# EAGLE design untitled (EAGLE 9.6.1)
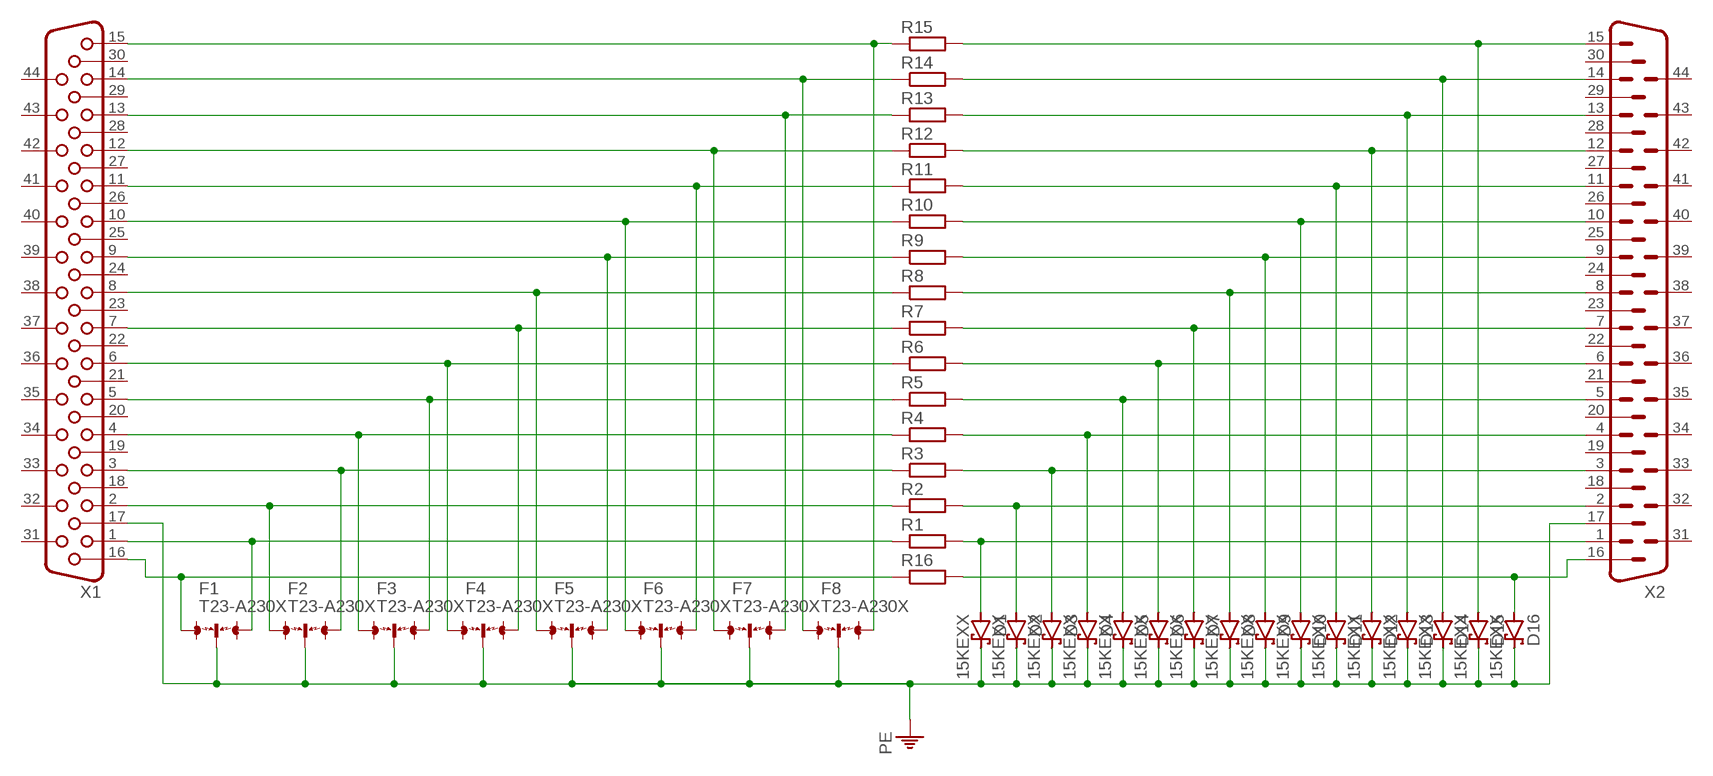
[diagram p0: schematic, sheet 1]

## Parts
D1  15KEXX  [CB429-17]
D2  15KEXX  [CB429-17]
D3  15KEXX  [CB429-17]
D4  15KEXX  [CB429-17]
D5  15KEXX  [CB429-17]
D6  15KEXX  [CB429-17]
D7  15KEXX  [CB429-17]
D8  15KEXX  [CB429-17]
D9  15KEXX  [CB429-17]
D10  15KEXX  [CB429-17]
D11  15KEXX  [CB429-17]
D12  15KEXX  [CB429-17]
D13  15KEXX  [CB429-17]
D14  15KEXX  [CB429-17]
D15  15KEXX  [CB429-17]
D16  15KEXX  [CB429-17]
F1  T23-A230X  [T23-A230X]
F2  T23-A230X  [T23-A230X]
F3  T23-A230X  [T23-A230X]
F4  T23-A230X  [T23-A230X]
F5  T23-A230X  [T23-A230X]
F6  T23-A230X  [T23-A230X]
F7  T23-A230X  [T23-A230X]
F8  T23-A230X  [T23-A230X]
R1  R-EU_R1210  [R1210]
R2  R-EU_R1210  [R1210]
R3  R-EU_R1210  [R1210]
R4  R-EU_R1210  [R1210]
R5  R-EU_R1210  [R1210]
R6  R-EU_R1210  [R1210]
R7  R-EU_R1210  [R1210]
R8  R-EU_R1210  [R1210]
R9  R-EU_R1210  [R1210]
R10  R-EU_R1210  [R1210]
R11  R-EU_R1210  [R1210]
R12  R-EU_R1210  [R1210]
R13  R-EU_R1210  [R1210]
R14  R-EU_R1210  [R1210]
R15  R-EU_R1210  [R1210]
R16  R-EU_R1210  [R1210]
X1  HF44H  [HDF44H]
X2  HM44H  [HDM44H]

## Nets
N$2: D16.A R16.2 X2.16
N$3: D1.A R1.2 X2.1
N$4: D2.A R2.2 X2.2
N$5: D3.A R3.2 X2.3
N$6: D4.A R4.2 X2.4
N$7: D5.A R5.2 X2.5
N$8: D6.A R6.2 X2.6
N$9: D7.A R7.2 X2.7
N$10: D8.A R8.2 X2.8
N$11: D9.A R9.2 X2.9
N$12: D10.A R10.2 X2.10
N$13: D11.A R11.2 X2.11
N$14: D12.A R12.2 X2.12
N$15: D13.A R13.2 X2.13
N$16: D14.A R14.2 X2.14
N$17: F1.3 R1.1 X1.1
N$18: F2.1 R2.1 X1.2
N$19: F2.3 R3.1 X1.3
N$20: F3.1 R4.1 X1.4
N$21: F3.3 R5.1 X1.5
N$22: F4.1 R6.1 X1.6
N$23: F4.3 R7.1 X1.7
N$24: F5.1 R8.1 X1.8
N$25: F5.3 R9.1 X1.9
N$26: F6.1 R10.1 X1.10
N$27: F6.3 R11.1 X1.11
N$28: F7.1 R12.1 X1.12
N$29: F7.3 R13.1 X1.13
N$30: F8.1 R14.1 X1.14
N$31: F8.3 R15.1 X1.15
N$32: F1.1 R16.1 X1.16
N$33: D15.A R15.2 X2.15
PE: D1.C D2.C D3.C D4.C D5.C D6.C D7.C D8.C D9.C D10.C D11.C D12.C D13.C D14.C D15.C D16.C F1.2 F2.2 F3.2 F4.2 F5.2 F6.2 F7.2 F8.2 X1.17 X2.17
Unconnected: X1.18 X1.19 X1.20 X1.21 X1.22 X1.23 X1.24 X1.25 X1.26 X1.27 X1.28 X1.29 X1.30 X1.31 X1.32 X1.33 X1.34 X1.35 X1.36 X1.37 X1.38 X1.39 X1.40 X1.41 X1.42 X1.43 X1.44 X2.18 X2.19 X2.20 X2.21 X2.22 X2.23 X2.24 X2.25 X2.26 X2.27 X2.28 X2.29 X2.30 X2.31 X2.32 X2.33 X2.34 X2.35 X2.36 X2.37 X2.38 X2.39 X2.40 X2.41 X2.42 X2.43 X2.44

## Library data of the parts
D1-D16 = diode:15KEXX: DIODE
F1-F8 = discrete:T23-A230X: 3-electrode arrester B88069X8740B502 Source: EPCOS .. t23a230xx8740.pdf
R1-R16 = rcl:R-EU_: RESISTOR, European symbol; SPICEPREFIX: R
X1 = con-subd:HF44: SUB-D; OC_FARNELL: unknown; OC_NEWARK: unknown
X2 = con-subd:HM44: SUB-D; OC_FARNELL: unknown; OC_NEWARK: unknown

## Board
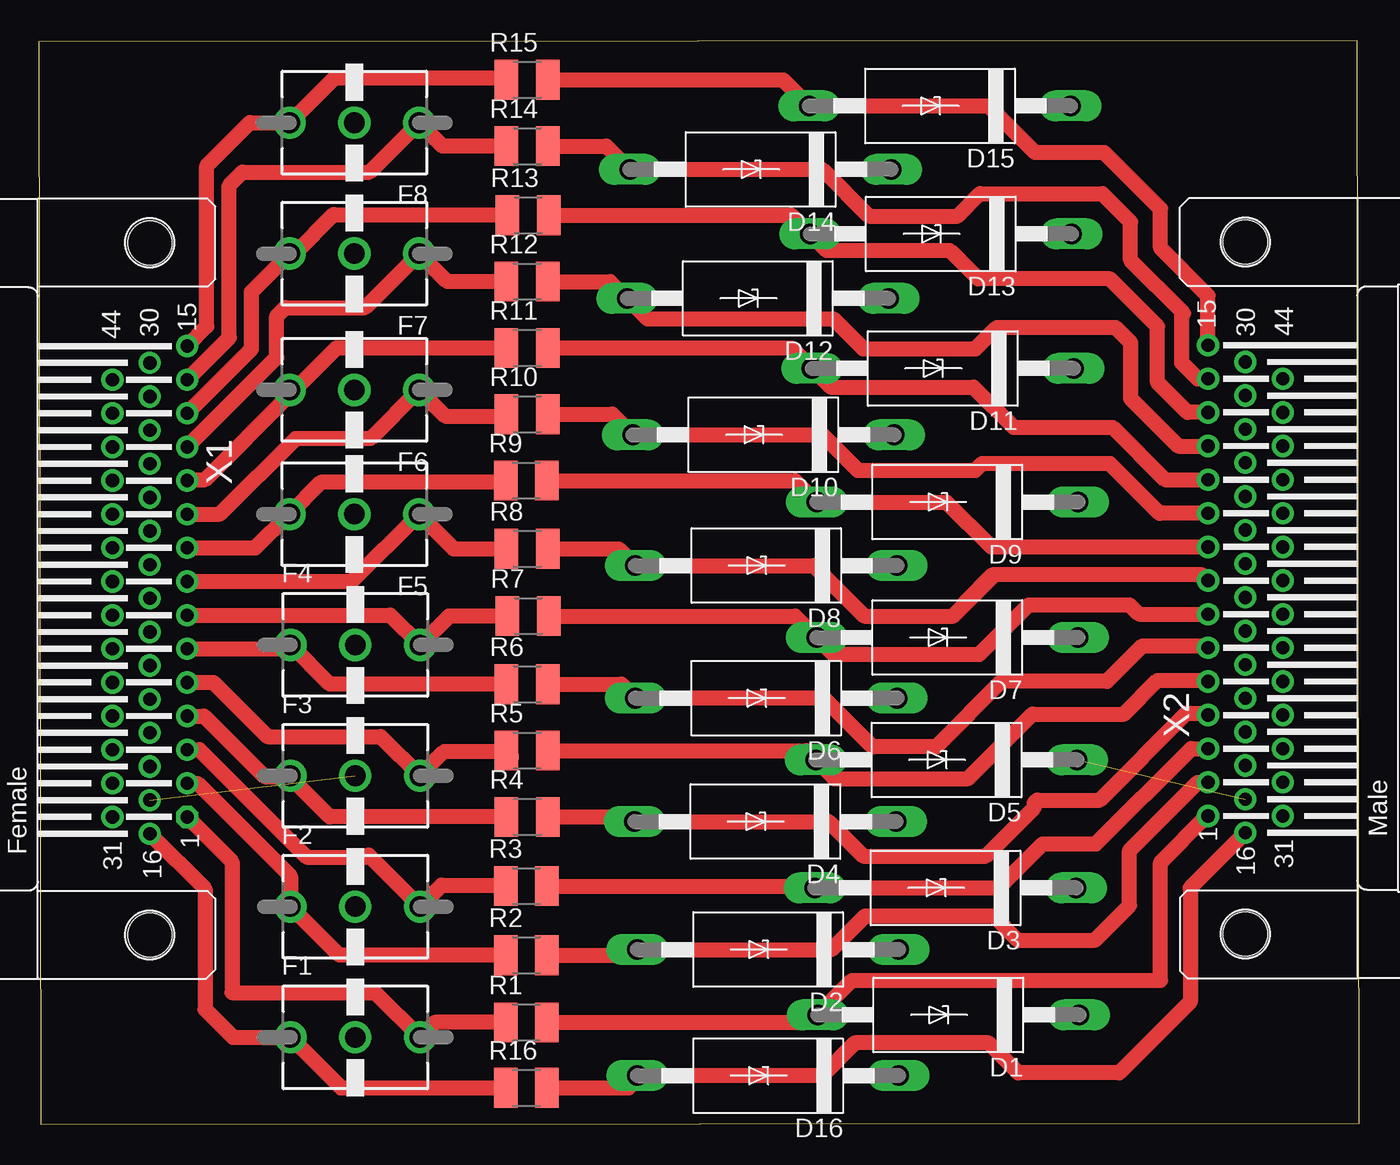
[diagram p1: board, top side]
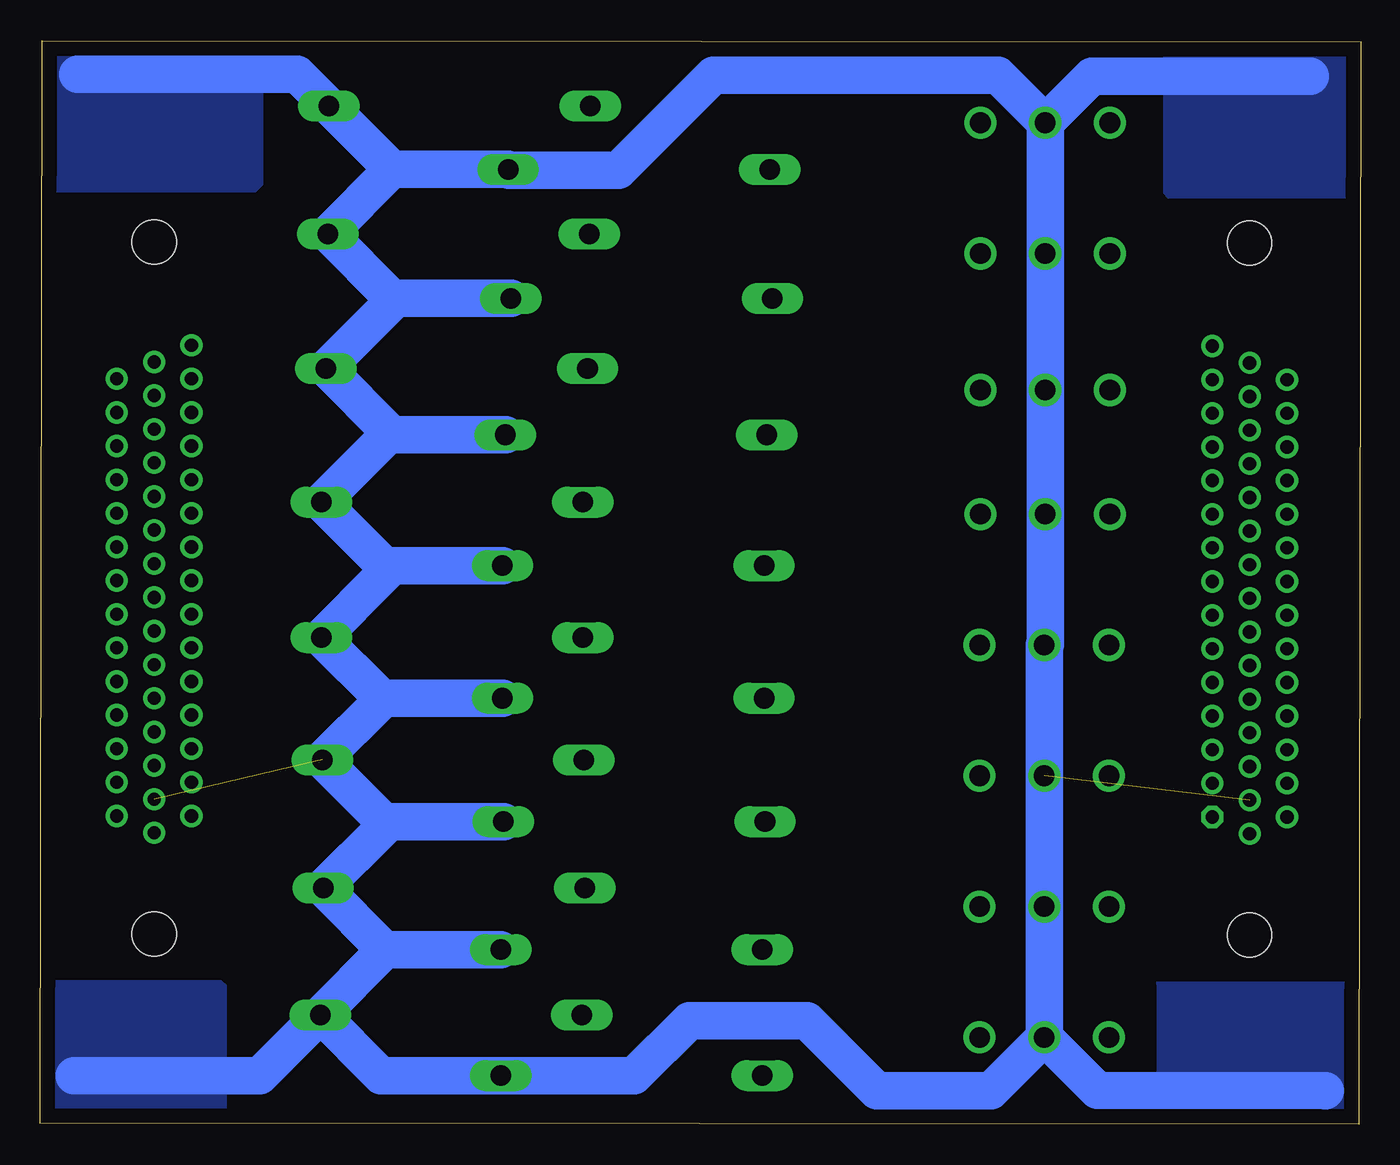
[diagram p2: board, bottom side, seen from below]

Size 89.78 x 73.65 mm. Coordinates in mm from the lower left corner, seen from the top.
Outline: 0.13,0 89.78,0.06 89.65,73.65 0,73.59 0.13,0
Copper layers (1*16): Top 0.035mm / dielectric 1.5mm / Bottom 0.035mm
Design rules "default": minimum track width 15mil, minimum drill 32mil, track to track 12mil, track to pad 12mil, pad to pad 12mil, via to via 12mil, smd to smd 6mil, copper to edge 40mil, drill to drill 40mil, minimum pad ring 12mil, minimum via ring 12mil, stop-mask expansion 4mil, vias tented up to drill 0mil, thermal gap 10mil

### Footprints (pad centres in the part's own frame; a part is rotated, then mirrored left to right if it is on the bottom)
CB429-17 = drill 1.397 long: A 8.89,0; C -8.89,0
T23-A230X = drill 1.4 pad 2.184: 1 -4.4,0; 2 0,0; 3 4.4,0
R1210 = smd 1.6 x 2.7: 1 -1.4,0; 2 1.4,0
HDF44H = drill 0.9 octagon: 1 15.497,2.54 | drill 0.9: 2 13.211,2.54; 3 10.925,2.54; 4 8.639,2.54; 5 6.353,2.54; 6 4.067,2.54; 7 1.781,2.54; 8 -0.505,2.54; 9 -2.791,2.54; 10 -5.077,2.54; 11 -7.363,2.54; 12 -9.649,2.54; 13 -11.935,2.54; 14 -14.221,2.54; 15 -16.507,2.54; 16 16.64,0; 17 14.354,0; 18 12.068,0; 19 9.782,0; 20 7.496,0; 21 5.21,0; 22 2.924,0; 23 0.638,0; 24 -1.648,0; 25 -3.934,0; 26 -6.22,0; 27 -8.506,0; 28 -10.792,0; 29 -13.078,0; 30 -15.364,0; 31 15.497,-2.54; 32 13.211,-2.54; 33 10.925,-2.54; 34 8.639,-2.54; 35 6.353,-2.54; 36 4.067,-2.54; 37 1.781,-2.54; 38 -0.505,-2.54; 39 -2.791,-2.54; 40 -5.077,-2.54; 41 -7.363,-2.54; 42 -9.649,-2.54; 43 -11.935,-2.54; 44 -14.221,-2.54 | hole 3: -23.52,0; 23.52,0
HDM44H = drill 0.9: 1 -15.497,2.54; 2 -13.211,2.54; 3 -10.925,2.54; 4 -8.639,2.54; 5 -6.353,2.54; 6 -4.067,2.54; 7 -1.781,2.54; 8 0.505,2.54; 9 2.791,2.54; 10 5.077,2.54; 11 7.363,2.54; 12 9.649,2.54; 13 11.935,2.54; 14 14.221,2.54; 15 16.507,2.54; 16 -16.64,0; 17 -14.354,0; 18 -12.068,0; 19 -9.782,0; 20 -7.496,0; 21 -5.21,0; 22 -2.924,0; 23 -0.638,0; 24 1.648,0; 25 3.934,0; 26 6.22,0; 27 8.506,0; 28 10.792,0; 29 13.078,0; 30 15.364,0; 31 -15.497,-2.54; 32 -13.211,-2.54; 33 -10.925,-2.54; 34 -8.639,-2.54; 35 -6.353,-2.54; 36 -4.067,-2.54; 37 -1.781,-2.54; 38 0.505,-2.54; 39 2.791,-2.54; 40 5.077,-2.54; 41 7.363,-2.54; 42 9.649,-2.54; 43 11.935,-2.54; 44 14.221,-2.54 | hole 3: -23.52,0; 23.52,0

### Placement (x,y rotation side)
D1  61.85,7.43 180 top
D2  49.59,11.87 180 top
D3  61.66,16.07 180 top
D4  49.4,20.57 180 top
D5  61.72,24.77 180 top
D6  49.47,28.96 180 top
D7  61.79,33.08 180 top
D8  49.47,37.97 180 top
D9  61.79,42.29 180 top
D10  49.28,46.86 180 top
D11  61.47,51.37 180 top
D12  48.9,56.13 180 top
D13  61.34,60.52 180 top
D14  49.09,64.9 180 top
D15  61.28,69.22 180 top
D16  49.59,3.3 180 top
F1  21.53,5.91 0 top
F2  21.53,14.8 0 top
F3  21.53,23.69 0 top
F4  21.53,32.58 0 top
F5  21.46,41.47 180 top
F6  21.46,49.91 180 top
F7  21.46,59.18 180 top
F8  21.46,68.07 180 top
R1  33.15,6.92 0 top
R2  33.15,11.49 0 top
R3  33.15,16.19 0 top
R4  33.21,20.89 0 top
R5  33.21,25.4 0 top
R6  33.21,29.91 0 top
R7  33.27,34.54 0 top
R8  33.21,39.12 0 top
R9  33.15,43.75 0 top
R10  33.21,48.26 0 top
R11  33.21,52.77 0 top
R12  33.21,57.28 0 top
R13  33.27,61.79 0 top
R14  33.21,66.48 0 top
R15  33.21,70.99 0 top
R16  33.15,2.48 0 top
X1  7.56,36.39 270 top
X2  82.04,36.45 90 top

### Tracks (layer width: path | path; a pad name or v marks a point on that pad's centre or on a via)
N$2
  Top 1.016: R16.2 40.13,2.48 40.13,2.73 D16.A 53.28,3.3 55.5,5.52 64.58,5.52 66.61,3.49 73.47,3.49 78.3,8.32 78.3,16.06 X2.16
N$3
  Top 1.016: R1.2 52.45,6.92 D1.A 55.31,9.78 76.26,9.78 76.26,17.78 79.44,20.95 X2.1
N$4
  Top 1.016: R2.2 40.32,11.49 D2.A 53.91,11.87 56.2,14.16 64.9,14.16 66.55,12.51 71.82,12.51 74.17,14.86 74.17,18.61 78.8,23.24 X2.2
N$5
  Top 1.016: R3.2 52.64,16.19 D3.A 65.28,16.07 68.26,19.05 71.88,19.05 78.36,25.52 X2.3
N$6
  Top 1.016: R4.2 40.2,20.89 D4.A 53.72,20.57 56.07,18.22 64.39,18.22 67.69,21.53 67.69,21.84 67.88,22.03 72.14,22.03 78.04,27.94 79.37,27.94 X2.4
N$7
  Top 1.016: R5.2 52.2,25.4 D5.A 54.04,23.56 54.04,23.5 63.18,23.5 67.56,27.88 73.79,27.88 76.07,30.16 79.44,30.16 X2.5
N$8
  Top 1.016: R6.2 39.62,29.91 D6.A 53.4,28.96 56.71,25.65 61.02,25.65 65.47,30.1 72.64,30.1 75.06,32.51 79.37,32.51 X2.6
N$9
  Top 1.016: R7.2 51.43,34.54 D7.A 54.04,31.94 63.94,31.94 67.31,35.31 74.16,35.31 74.8,34.67 X2.7
N$10
  Top 1.016: R8.2 39.43,39.12 D8.A 52.71,37.97 56.13,34.54 62.17,34.54 64.84,37.21 64.84,37.33 | X2.8 79.12,37.33 64.84,37.33 | 64.84,37.33 63,35.5
N$11
  Top 1.016: R9.2 51.43,43.75 D9.A 61.72,42.29 64.77,39.24 X2.9
N$12
  Top 1.016: R10.2 38.99,48.26 D10.A 53.28,46.86 55.69,44.45 63.69,44.45 64.13,44.89 72.83,44.89 76.2,41.53 X2.10
N$13
  Top 1.016: R11.2 51.18,52.77 D11.A 53.85,50.1 63.56,50.1 66.29,47.37 73.02,47.37 76.58,43.81 X2.11
N$14
  Top 1.016: R12.2 38.86,57.28 D12.A 41.4,54.74 54.04,54.74 56.07,52.71 63.69,52.71 65.15,54.17 73.22,54.17 74.23,53.15 74.23,49.34 77.47,46.1 X2.12
N$15
  Top 1.016: R13.2 51.18,61.79 D13.A 53.56,59.4 61.94,59.4 63.88,57.47 72.83,57.47 76.07,54.23 76.07,50.42 78.11,48.38 X2.13
N$16
  Top 1.016: R14.2 38.61,66.48 D14.A 53.28,64.9 56.45,61.72 62.48,61.72 64.01,63.25 72.33,63.25 74.23,61.34 74.23,58.74 77.85,55.12 77.72,54.99 77.72,51.75 78.81,50.67 X2.14
N$17
  Top 1.016: X1.1 13.14,17.84 13.14,8.95 22.88,8.95 F1.3 26.94,6.92 R1.1
N$18
  Top 1.016: X1.2 10.8,23.17 17.13,16.85 F2.1 20.43,11.49 R2.1
N$19
  Top 1.016: X1.3 10.92,25.46 18.22,18.16 22.29,18.16 22.42,18.29 22.43,18.29 F2.3 27.39,16.26 31.68,16.26 R3.1
N$20
  Top 1.016: X1.4 11.24,27.75 15.37,23.62 17.06,23.62 | 17.06,23.62 F3.1 | 17.06,23.62 19.79,20.89 R4.1
N$21
  Top 1.016: X1.5 11.88,30.03 15.56,26.35 23.26,26.35 F3.3 27.58,25.34 31.69,25.34 32.13,24.89 32.13,25.08 R5.1
N$22
  Top 1.016: X1.6 16.87,32.32 F4.1 19.79,29.91 R6.1
N$23
  Top 1.016: X1.7 23.9,34.6 F4.3 27.9,34.54 R7.1
N$24
  Top 1.016: X1.8 21.29,36.89 F5.1 28.21,39.12 R8.1
N$25
  Top 1.016: X1.9 14.73,39.18 17.02,41.47 | 17.02,41.47 F5.3 | 17.02,41.47 19.18,43.62 31.62,43.62 R9.1
N$26
  Top 1.016: X1.10 12.32,41.46 17.46,46.61 22.56,46.61 F6.1 27.64,48.13 31.68,48.13 R10.1
N$27
  Top 1.016: X1.11 10.16,43.82 11.3,43.82 17.06,49.57 | 17.06,49.57 F6.3 | 17.06,49.57 20.26,52.77 R11.1
N$28
  Top 1.016: X1.12 16.19,52.13 16.19,54.93 16.76,55.5 22.18,55.5 F7.1 27.77,57.28 R12.1
N$29
  Top 1.016: X1.13 14.48,52.7 14.48,56.6 F7.3 17.4,59.18 20.07,61.85 20.13,61.79 R13.1
N$30
  Top 1.016: X1.14 12.95,53.46 12.95,63.82 13.84,64.71 22.5,64.71 F8.1 27.45,66.48 R14.1
N$31
  Top 1.016: X1.15 11.43,54.23 11.43,65.15 14.35,68.07 F8.3 20.11,71.12 31.68,71.12 R15.1
N$32
  Top 1.016: X1.16 11.3,16 11.3,7.81 13.21,5.91 F1.1 20.56,2.48 R16.1
N$33
  Top 1.016: R15.2 50.61,70.99 D15.A 64.58,69.22 67.75,66.04 72.45,66.04 76.26,62.23 76.26,59.56 79.5,56.32 X2.15
PE  (2 unrouted)
  Bottom 2.54: F8.2 F7.2 F6.2 F5.2 21.46,32.64 F4.2 F3.2 F2.2 F1.2 | 65.85,64.9 D15.C 72.33,71.37 87.25,71.37 | 65.85,64.9 D14.C 57.91,64.83 50.48,64.83 44.02,71.3 24.69,71.3 F8.2 | 65.85,56.13 D13.C 65.85,64.9 | 65.85,56.13 D12.C | 65.85,46.86 D11.C 65.85,55.88 65.85,56.13 | 65.85,46.86 D10.C | 66.36,37.97 D9.C 66.1,46.86 65.85,46.86 | 66.36,37.97 D8.C | 66.55,28.96 D7.C 66.36,37.4 66.36,37.97 | 66.55,28.96 D6.C | 66.42,20.57 D5.C 66.55,28.83 66.55,28.96 | 66.42,20.57 D4.C | 66.36,11.87 D3.C 66.42,20.19 66.42,20.57 | 66.36,11.87 D2.C | D1.C 66.61,3.3 D16.C 49.4,3.3 45.66,7.05 37.66,7.05 32.89,2.29 25.15,2.29 F1.2 | D1.C 66.36,11.81 66.36,11.87 | F1.2 17.92,2.3 2.41,2.29 | D1.C 74.87,3.3 87.48,3.3 | F8.2 18.29,71.25 3.43,71.25
  pour Bottom (no thermals): 0.38,9.65 0.38,0.32 13.78,0.32 13.78,9.52 13.84,9.59 0.44,9.59
  pour Bottom: 89.53,9.72 89.53,0.32 89.47,0.25 77.22,0.25 77.15,0.32 77.15,9.4 77.47,9.72
  pour Bottom: 74.74,73.03 74.74,63.88 75.18,63.44 89.22,63.44 89.34,63.31 89.34,73.41 89.41,73.47 75.12,73.47 74.74,73.09
  pour Bottom: 0.32,73.28 0.32,63.06 13.08,63.06 13.34,63.31 13.34,73.28 13.4,73.34 0.32,73.34